# Altium schematic sheet LiPoCharger.SchDoc
size A
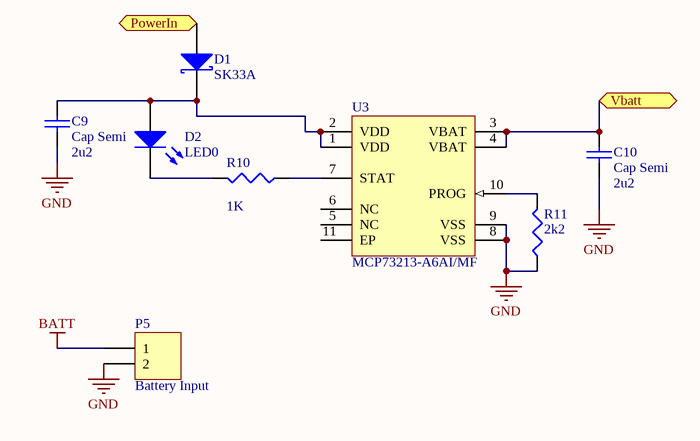
[diagram p0: LiPoCharger.SchDoc]

## Parts
C9  Cap Semi  value 2u2  [1608[0603]]
C10  Cap Semi  value 2u2  [1608[0603]]
D1  SK33A  [SMB]
D2  LED0  [0603 LED]
P5  Battery Input  [HDR1X2]
R10  value 1K  [J1-0603]  (hidden comment: Res3)
R11  value 2k2  [J1-0603]
U3  MCP73213-A6AI/MF  [DFN-MF10]

## Ports
PowerIn (in), Vbatt (bidir)

## Nets
BATT: P5.1
GND: C9.1 C10.1 P5.2 R11.1 U3.8(VSS) U3.9(VSS)
PowerIn: D1.1(A) ; port PowerIn
Vbatt: C10.2 U3.3(VBAT) U3.4(VBAT) ; port Vbatt
NetC9_2: C9.2 D1.2(K) D2.1(A) U3.1(VDD) U3.2(VDD)
NetD2_2: D2.2(K) R10.2
NetR10_1: R10.1 U3.7(STAT)
NetR11_2: R11.2 U3.10(PROG)

Not connected (* = marked no-connect by the designer): U3 5(NC) 6(NC) 11(EP)

## Library data of the parts
C9 C10 = Cap Semi: Capacitor (Semiconductor SIM Model); Published: 8-Jun-2000; LatestRevisionDate: 29-May-2009; LatestRevisionNote: IPC-7351 Footprint Added.; PackageReference: C1206; Publisher: Altium Limited; PackageDescription: Chip Capacitor
D1 = D Schottky: Schottky Diode; Published: 8-Jun-2000; LatestRevisionDate: 17-Jul-2002; LatestRevisionNote: Re-released for DXP Platform.; PackageReference: SMB; Publisher: Altium Limited; PackageDescription: DO-214-AA/SMB; 2 C-Bend Leads; Body 5.3 x 3.6 mm, inc. leads (LxW); Code_JEDEC: DO-214-AA
D2 = LED0: Typical INFRARED GaAs LED; Published: 8-Jun-2000; LatestRevisionDate: 08-Jul-2005; LatestRevisionNote: Mech Layer 1 removed.; PackageReference: LED-0; Publisher: Altium Limited; PackageDescription: LED; 2 Leads
P5 = Header 2: Header, 2-Pin; LatestRevisionDate: 17-Jul-2002; LatestRevisionNote: Re-released for DXP Platform.; Publisher: Altium Limited
R10 R11 = Res3: Resistor; Published: 8-Jun-2000; LatestRevisionDate: 29-May-2009; LatestRevisionNote: IPC-7351 Footprint Added.; PackageReference: J1-0603; Publisher: Altium Limited; PackageDescription: Chip Resistor
U3 = MCP73213-A6AI/MF: Dual-Cell Li-Ion / Li-Polymer Battery Charge Management Controller with OVP, 13V, 10-Pin DFN, Industrial Temperature; Published: 2-Dec-2009; DatasheetVersion: revA, Jul-2009; PackageVersion: revBB, Aug-2009; PackageReference: DFN-MF10; Publisher: Altium Limited; PackageDescription: 10-Lead Plastic Dual Flat, No Lead Package (MF) - 3x3x0.9mm Body [DFN]; ComponentLink1Description: Datasheet; ComponentLink1URL: http://ww1.microchip.com/downloads/en/DeviceDoc/22190a.pdf; ComponentLink2Description: Packaging Specification; ComponentLink2URL: http://www.microchip.com/stellent/groups/techpub_sg/documents/packagingspec/en012702.pdf; ComponentLink3Description: Microchip.com Home; ComponentLink3URL: http://www.microchip.com/